# Altium schematic sheet brake.SchDoc
size A4
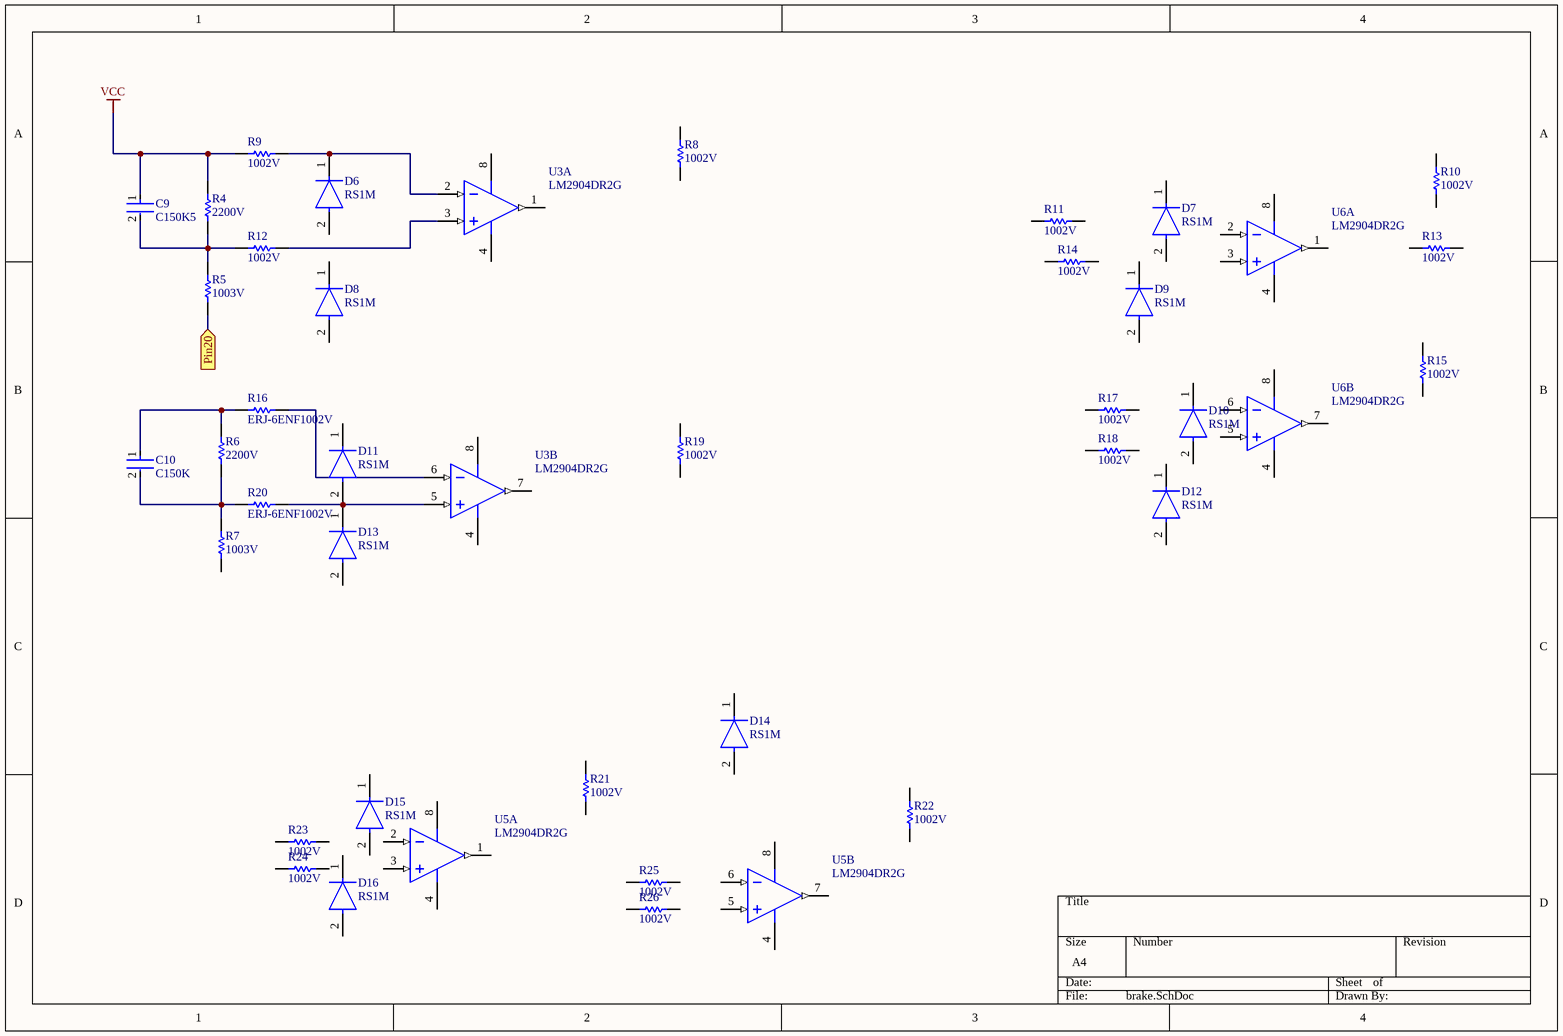
[diagram p0: brake.SchDoc]

## Parts
C9  C150K5  [FP-C0805C-DN-MFG]
C10  C150K  [FP-C0805C-DN-MFG]
D6  RS1M  [FP-403AE-MFG]
D7  RS1M  [FP-403AE-MFG]
D8  RS1M  [FP-403AE-MFG]
D9  RS1M  [FP-403AE-MFG]
D10  RS1M  [FP-403AE-MFG]
D11  RS1M  [FP-403AE-MFG]
D12  RS1M  [FP-403AE-MFG]
D13  RS1M  [FP-403AE-MFG]
D14  RS1M  [FP-403AE-MFG]
D15  RS1M  [FP-403AE-MFG]
D16  RS1M  [FP-403AE-MFG]
R4  2200V  [RESC2013X70X40NL20T20]
R5  1003V  [RESC2013X70X40LL20T20]
R6  2200V  [RESC2013X70X40NL20T20]
R7  1003V  [RESC2013X70X40LL20T20]
R8  1002V  [RESC2013X70X40ML20T20]
R9  1002V  [RESC2013X70X40ML20T20]
R10  1002V  [RESC2013X70X40ML20T20]
R11  1002V  [RESC2013X70X40ML20T20]
R12  1002V  [RESC2013X70X40ML20T20]
R13  1002V  [RESC2013X70X40ML20T20]
R14  1002V  [RESC2013X70X40ML20T20]
R15  1002V  [RESC2013X70X40ML20T20]
R16  ERJ-6ENF1002V  [RESC2013X70X40ML20T20]
R17  1002V  [RESC2013X70X40ML20T20]
R18  1002V  [RESC2013X70X40ML20T20]
R19  1002V  [RESC2013X70X40ML20T20]
R20  ERJ-6ENF1002V  [RESC2013X70X40ML20T20]
R21  1002V  [RESC2013X70X40ML20T20]
R22  1002V  [RESC2013X70X40ML20T20]
R23  1002V  [RESC2013X70X40ML20T20]
R24  1002V  [RESC2013X70X40ML20T20]
R25  1002V  [RESC2013X70X40ML20T20]
R26  1002V  [RESC2013X70X40ML20T20]
U3  LM2904DR2G  [ONSC-SOIC-8-751-07_V]  (parts A,B of 2)
U5  LM2904DR2G  [ONSC-SOIC-8-751-07_V]  (parts A,B of 2)
U6  LM2904DR2G  [ONSC-SOIC-8-751-07_V]  (parts A,B of 2)

## Ports
Pin20 (in)

## Nets
VCC: C9.1 R4.2 R9.1
Pin20: R5.1 ; port Pin20
NetC9_2: C9.2 R4.1 R5.2 R12.1
NetC10_1: C10.1 R6.2 R16.1
NetC10_2: C10.2 R6.1 R7.2 R20.1
NetD6_1: D6.1(C) R9.2 U3.2(INA-)
NetD11_2: D11.2(A) D13.1(C) R20.2 U3.5(INB+)
NetR12_2: R12.2 U3.3(INA+)
NetR16_2: R16.2 U3.6(INB-)

Not connected (* = marked no-connect by the designer): D6 2(A); D7 1(C) 2(A); D8 1(C) 2(A); D9 1(C) 2(A); D10 1(C) 2(A); D11 1(C); D12 1(C) 2(A); D13 2(A); D14 1(C) 2(A); D15 1(C) 2(A); D16 1(C) 2(A); R7 1; R8 1 2; R10 1 2; R11 1 2; R13 1 2; R14 1 2; R15 1 2; R17 1 2; R18 1 2; R19 1 2; R21 1 2; R22 1 2; R23 1 2; R24 1 2; R25 1 2; R26 1 2; U3 1(OUTA) 4(VEE/GND) 7(OUTB) 8(VCC); U5 1(OUTA) 2(INA-) 3(INA+) 4(VEE/GND) 5(INB+) 6(INB-) 7(OUTB) 8(VCC); U6 1(OUTA) 2(INA-) 3(INA+) 4(VEE/GND) 5(INB+) 6(INB-) 7(OUTB) 8(VCC)

## Library data of the parts
C9 C10 = CMP-03020-029354-1: CAP CER 15PF 50V 10% NP0 0805; Manufacturer: KEMET; Manufacturer Part Number: C0805C150K5GACTU; Temperature Characteristic: C0G; Tolerance: 0.1; Description: C0805 15 pF C0G 30ppm/°C 10.00% 50 V; Temperature Coefficient: 30ppm/°C; Material: Ceramic; Voltage Rating: 50 V; ComponentLink2Description: Datasheet; Device Class L1: Passive Components; Device Class L2: Capacitors; RoHS: TRUE; Mouser Description: Cap Ceramic 15pF 50V C0G 10% SMD 0805 125°C Paper T/R; Category: Cap; Device Class L3: Ceramic Capacitors; Octopart: https://octopart.com/c0805c150k5gactu-kemet-6813460; Temperature Range Low: -55°C; Ipc Land Pattern Name: CAPC200125X78; Digikey Description: CAP CER 15PF 50V 10% NP0 0805; Height: 0.88mm; Value: 15 pF; Lead Free: Yes; Temperature Range High: +125°C; Temperature: -55°C to +125°C; ComponentLink2URL: https://content.kemet.com/datasheets/KEM_C1003_C0G_SMD.pdf; Package: C0805C-DN; Capacitance: 15 pF; Automotive: No
D6-D16 = CMP-07163-000022-1: DIODE GEN PURP 1KV 1A SMA; Manufacturer: ON Semiconductor; Max Surge Forward Current: 30A; Max Repetitive Reverse Voltage: 1000V; Value: 10pF; Max Junction Temp: +150°C; Description: Diode Standard 1000V 1A Surface Mount SMA (DO-214AC); Peak Reverse Current: 5uA; Standoff Height: 0.05mm; ComponentLink2URL: https://www.onsemi.com/pub/Collateral/RS1M-D.PDF; Footprint Url: https://www.onsemi.com/pub/Collateral/403AE.PDF; Mouser Description: On a Reel of 7500, ON Semi 1000V 1A, Diode, 2-Pin DO-214AC RS1M; Package: 403AE; Manufacturer Part Number: RS1M; Temperature Range Low: -55°C; Device Class L1: Discrete Semiconductors; Automotive: No; Height: 2.5mm; Octopart: https://octopart.com/rs1m-on+semiconductor-84331238; Digikey Description: DIODE GEN PURP 1KV 1A SMA; Temperature Range High: +150°C; Capacitance: 10pF; RoHS: TRUE; Device Class L2: Diodes; ComponentLink2Description: Datasheet; Temperature: -55°C to +150°C; Device Class L3: Rectifier Diodes; Forward Current: 1A; Lead Free: Yes; Category: Diode
R4 R6 = CMP-2001-00044-1: Part Number: ERJ6ENF2200V; Manufacturer: Panasonic
R5 R7 = CMP-2001-04377-1: Part Number: ERJ-6ENF1003V; Manufacturer: Panasonic
R8-R15 R17-R19 R21-R26 = CMP-2001-04376-1: Manufacturer: Panasonic; Part Number: ERJ-6ENF1002V
R16 R20 = CMP-2001-04376-1: Manufacturer: Panasonic; Part Number: ERJ-6ENF1002V
U3 U5 U6 = CMP-1310-00321-1: Single Supply Dual Operational Amplifier, 3 to 32 V, -40 to 105 degC, 8-Pin SOIC, Pb-Free, Tape and Reel; Manufacturer: On Semiconductor; VCC Min (V): 3; VCC Max (V): 32; PackageDescription: 8-Pin Small Outline Integrated Circuit, Body 4.9 x 3.9 mm, Pitch 1.27 mm; RoHS: TRUE; ComponentLink1URL: http://www.onsemi.com/; Mounting Technology: Surface Mount; PackageReference: SOIC-8-751-07; Packing: Tape and Reel; DatasheetVersion: Rev. 27; PartNumber: LM2904DR2G; PackageVersion: Rev. AK, 02/2011; ComponentLink1Description: Manufacturer URL; ComponentLink3URL: http://www.onsemi.com/pub_link/Collateral/751-07.PDF; ComponentLink2Description: Datasheet; ComponentLink3Description: Package Specification; ComponentLink2URL: http://www.onsemi.cn/pub_link/Collateral/LM358-D.PDF